# EAGLE design snes_visualization_left (EAGLE 6.4)
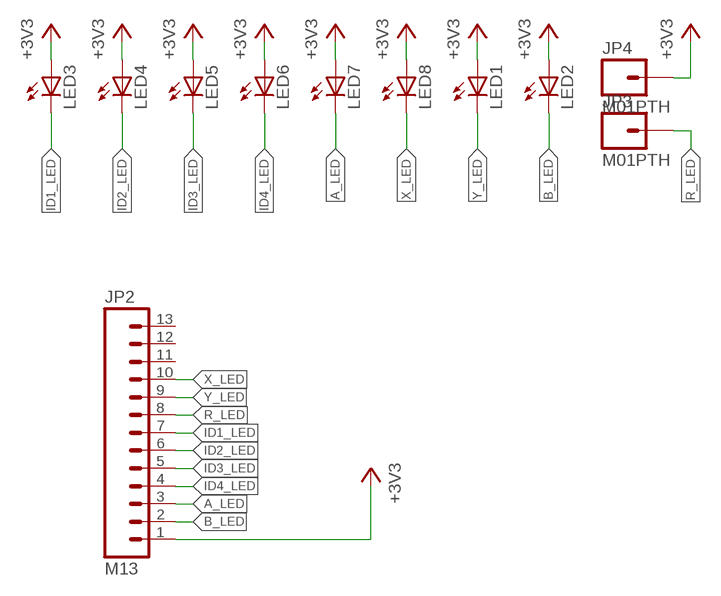
[diagram p0: schematic, sheet 1]

## Parts
JP2  M13  [1X13]
JP3  M01PTH  [1X01]
JP4  M01PTH  [1X01]
LED1  LED5MM  [LED5MM]
LED2  LED5MM  [LED5MM]
LED3  LED5MM  [LED5MM]
LED4  LED5MM  [LED5MM]
LED5  LED5MM  [LED5MM]
LED6  LED5MM  [LED5MM]
LED7  LED5MM  [LED5MM]
LED8  LED5MM  [LED5MM]

## Nets
+3V3: JP2.1 JP4.1 LED1.A LED2.A LED3.A LED4.A LED5.A LED6.A LED7.A LED8.A
A_LED: JP2.3 LED7.K(C)
B_LED: JP2.2 LED2.K(C)
ID1_LED: JP2.7 LED3.K(C)
ID2_LED: JP2.6 LED4.K(C)
ID3_LED: JP2.5 LED5.K(C)
ID4_LED: JP2.4 LED6.K(C)
R_LED: JP2.8 JP3.1
X_LED: JP2.10 LED8.K(C)
Y_LED: JP2.9 LED1.K(C)
Unconnected: JP2.11 JP2.12 JP2.13

## Library data of the parts
JP2 = SparkFun-Connectors:M13: 13-pin single row .1" header
JP3 JP4 = SparkFun-Connectors:M01: Header 1 Standard 1-pin 0.1" header. Use with straight break away headers (SKU : PRT-00116), right angle break away headers (PRT-00553), swiss pins (PRT-00743), machine pins (PRT-00117), and female headers (PRT-00115).
LED1-LED8 = led:LED: LED OSRAM: - CHIPLED LG R971, LG N971, LY N971, LG Q971, LY Q971, LO R971, LY R971 LH N974, LH R974 LS Q976, LO Q976, LY Q976 LO Q996 - Hyper CHIPLED LW Q18S LB Q993, LB Q99A, LB R99A - SideLED LS A670, LO A670, LY A670, LG A670, LP A670 LB A673, LV A673, LT A673, LW A673 LH A674 LY A675 LS A676, LA A676, LO A676, LY A676, LW A676 LS A679, LY A679, LG A679 - Hyper Micro SIDELED® LS Y876, LA Y876, LO Y876, LY Y876 LT Y87S - SmartLED LW L88C, LW L88S LB L89C, LB L89S, LG L890 LS L89K, LO L89K, LY L89K LS L896, LA L896, LO L896, LY L896 - TOPLED LS T670, LO T670, LY T670, LG T670, LP T670 LSG T670, LSP T670, LSY T670, LOP T670, LYG T670 LG T671, LOG T671, LSG T671 LB T673, LV T673, LT T673, LW T673 LH T674 LS T676, LA T676, LO T676, LY T676, LB T676, LH T676, LSB T676, LW T676 LB T67C, LV T67C, LT T67C, LS T67K, LO T67K, LY T67K, LW E67C LS E67B, LA E67B, LO E67B, LY E67B, LB E67C, LV E67C, LT E67C LW T67C LS T679, LY T679, LG T679 LS T770, LO T770, LY T770, LG T770, LP T770 LB T773, LV T773, LT T773, LW T773 LH T774 LS E675, LA E675, LY E675, LS T675 LS T776, LA T776, LO T776, LY T776, LB T776 LHGB T686 LT T68C, LB T68C - Hyper Mini TOPLED® LB M676 - Mini TOPLED Santana® LG M470 LS M47K, LO M47K, LY M47K Source: http://www.osram.convergy.de LUXEON: - LUMILED® LXK2-PW12-R00, LXK2-PW12-S00, LXK2-PW14-U00, LXK2-PW14-V00 LXK2-PM12-R00, LXK2-PM12-S00, LXK2-PM14-U00 LXK2-PE12-Q00, LXK2-PE12-R00, LXK2-PE12-S00, LXK2-PE14-T00, LXK2-PE14-U00 LXK2-PB12-K00, LXK2-PB12-L00, LXK2-PB12-M00, LXK2-PB14-N00, LXK2-PB14-P00, LXK2-PB14-Q00 LXK2-PR12-L00, LXK2-PR12-M00, LXK2-PR14-Q00, LXK2-PR14-R00 LXK2-PD12-Q00, LXK2-PD12-R00, LXK2-PD12-S00 LXK2-PH12-R00, LXK2-PH12-S00 LXK2-PL12-P00, LXK2-PL12-Q00, LXK2-PL12-R00 Source: www.luxeon.com KINGBRIGHT: KA-3528ASYC Source: www.kingbright.com

## Board
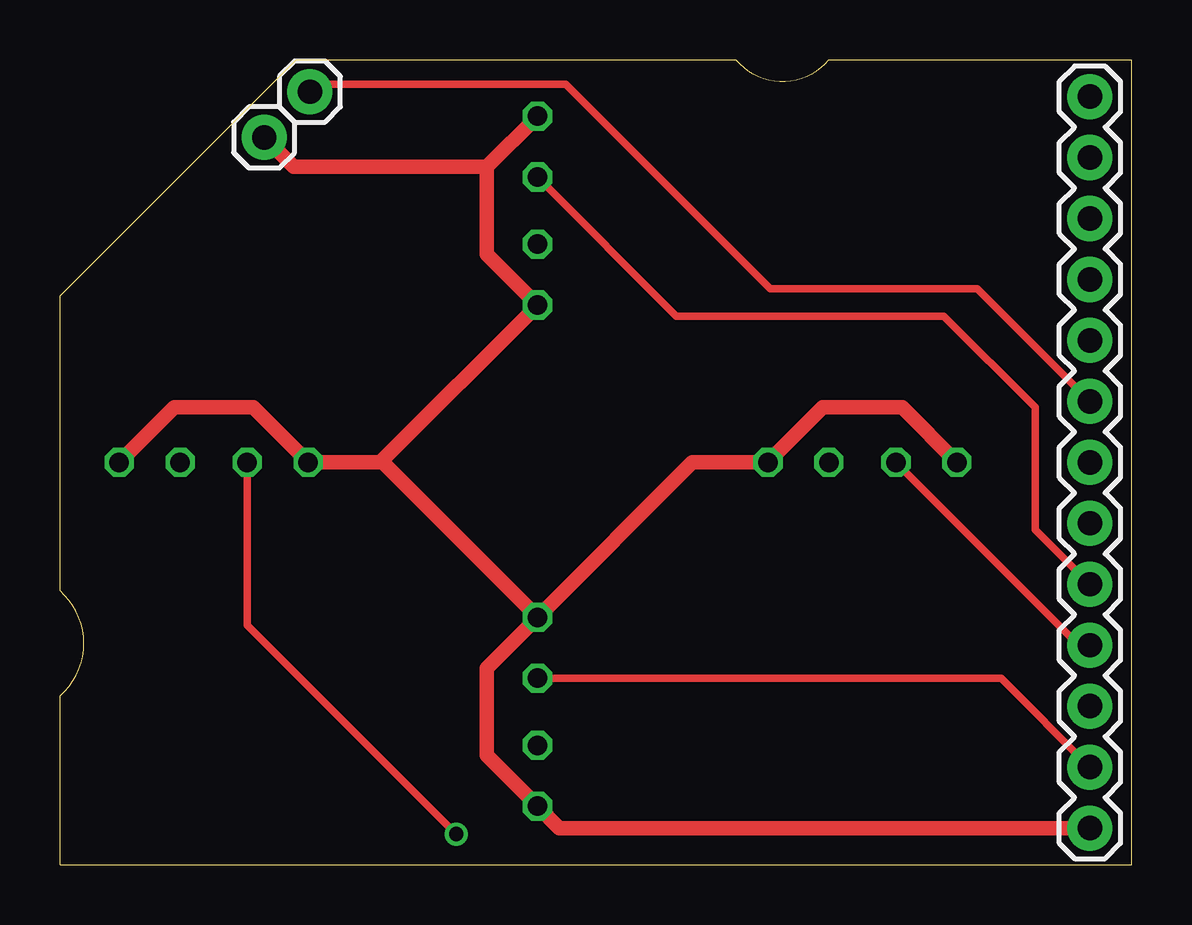
[diagram p1: board, top side]
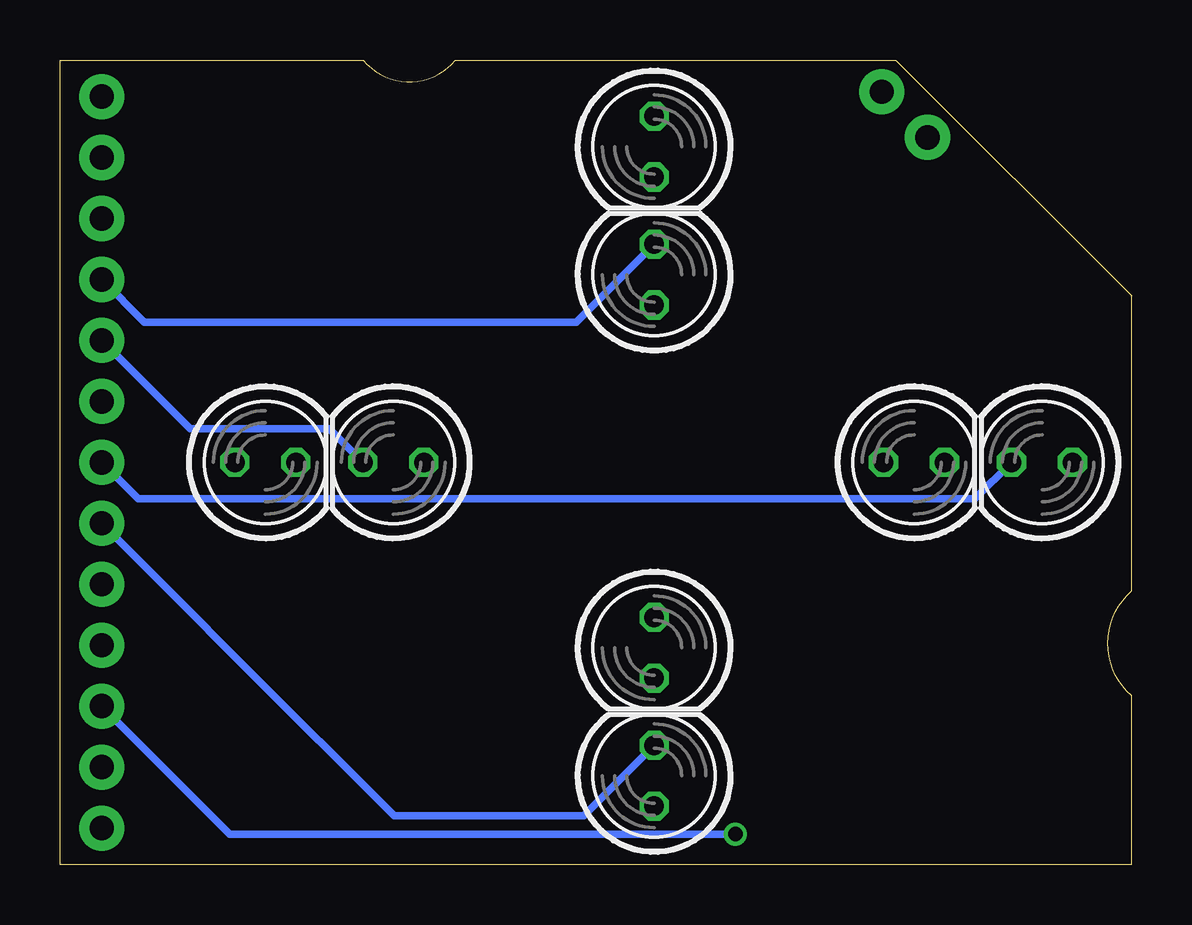
[diagram p2: board, bottom side, seen from below]

Size 44.65 x 33.53 mm. Coordinates in mm from the lower left corner, seen from the top.
Outline: 0,0 44.65,0 44.65,33.53 32.02,33.53 arc-102 28.18,33.53 9.83,33.53 0,23.7 0,11.4 arc-98 0,7.04 0,0
Copper layers (1*16): Top 0.0356mm / dielectric 1.5011mm / Bottom 0.0356mm
Design rules "LaenPCBOrder *": minimum track width 6mil, minimum drill 13mil, track to track 6mil, track to pad 6mil, pad to pad 6mil, via to via 6mil, smd to smd 6mil, copper to edge 15mil, drill to drill 6mil, minimum pad ring 7mil, minimum via ring 7mil, stop-mask expansion 3mil, vias tented up to drill 24mil, thermal gap 10mil

### Footprints (pad centres in the part's own frame; a part is rotated, then mirrored left to right if it is on the bottom)
1X13 = drill 1.016 pad 1.88: 1 0,0; 2 2.54,0; 3 5.08,0; 4 7.62,0; 5 10.16,0; 6 12.7,0; 7 15.24,0; 8 17.78,0; 9 20.32,0; 10 22.86,0; 11 25.4,0; 12 27.94,0; 13 30.48,0
1X01 = drill 1.016 pad 1.88: 1 0,0
LED5MM = drill 0.813 octagon: A -1.27,0; K 1.27,0

### Placement (x,y rotation side)
JP2  42.91,1.52 90 top
JP3  10.41,32.21 0 top
JP4  8.51,30.3 0 top
LED1  30.77,16.76 180 bottom
LED2  19.9,9.04 270 bottom
LED3  3.74,16.76 180 bottom
LED4  19.9,3.7 90 bottom
LED5  19.9,29.92 270 bottom
LED6  36.1,16.76 0 bottom
LED7  9.07,16.76 0 bottom
LED8  19.9,24.59 90 bottom

### Tracks (layer width: path | path; a pad name or v marks a point on that pad's centre or on a via)
+3V3
  Top 0.61: JP2.1 20.81,1.52 LED4.A 17.78,4.55 17.78,8.19 LED2.A | LED2.A 13.44,16.76 13.35,16.76 | 13.35,16.76 LED7.A 8.05,19.05 4.75,19.05 LED3.A | 13.35,16.76 LED8.A 17.78,25.43 17.78,29.07 | 17.78,29.07 LED5.A | LED6.A 35.08,19.05 31.78,19.05 LED1.A 26.35,16.76 LED2.A | 17.78,29.07 9.74,29.07 JP4.1
A_LED  (via drill 0.6)
  Top 0.305: v16.51,1.27 7.8,9.98 LED7.K
  Bottom 0.305: JP2.3 37.58,1.27 v16.51,1.27
B_LED
  Top 0.305: LED2.K 39.21,7.77 JP2.2
ID1_LED
  Bottom 0.305: LED3.K 6.53,15.24 41.39,15.24 JP2.7
ID2_LED
  Bottom 0.305: JP2.6 34.03,5.34 33.66,4.97 30.72,2.03 22.84,2.03 LED4.K
ID3_LED
  Top 0.305: JP2.5 40.64,13.96 40.64,19.05 36.83,22.86 25.68,22.86 LED5.K
ID4_LED
  Top 0.305: LED6.K 42.45,9.14 JP2.4
R_LED
  Top 0.305: JP2.8 38.21,24 29.59,24 21.08,32.51 10.72,32.51 JP3.1
X_LED
  Bottom 0.305: LED8.K 23.15,22.61 41.13,22.61 JP2.10
Y_LED
  Bottom 0.305: LED1.K 33.43,18.16 39.23,18.16 JP2.9